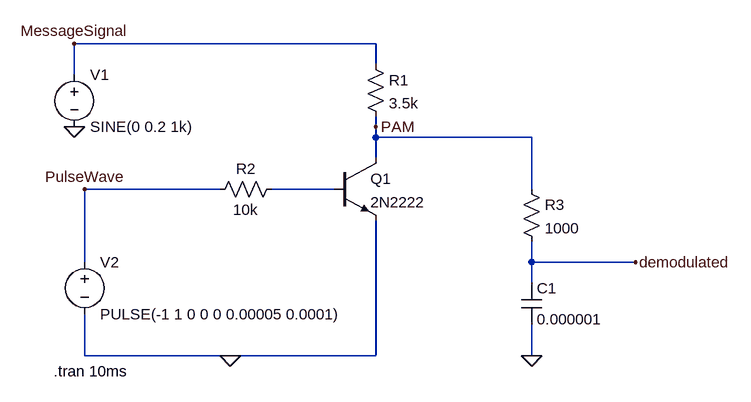
[diagram p0: schematic pam_demod_natural.asc]
pam_demod_natural.asc, the LTspice schematic file:
Version 4
SHEET 1 880 680
WIRE -400 -48 -864 -48
WIRE -400 -16 -400 -48
WIRE -864 0 -864 -48
WIRE -400 80 -400 64
WIRE -400 96 -400 80
WIRE -160 96 -400 96
WIRE -400 128 -400 96
WIRE -640 176 -848 176
WIRE -464 176 -560 176
WIRE -160 176 -160 96
WIRE -848 288 -848 176
WIRE -160 288 -160 256
WIRE 0 288 -160 288
WIRE -160 320 -160 288
WIRE -848 432 -848 368
WIRE -624 432 -848 432
WIRE -400 432 -400 224
WIRE -400 432 -624 432
WIRE -160 432 -160 384
FLAG -864 80 0
FLAG -624 432 0
FLAG -400 80 PAM
FLAG -864 -48 MessageSignal
FLAG -848 176 PulseWave
FLAG -160 432 0
FLAG 0 288 demodulated
SYMBOL npn -464 128 R0
SYMATTR InstName Q1
SYMATTR Value 2N2222
SYMBOL res -416 -32 R0
SYMATTR InstName R1
SYMATTR Value 3.5k
SYMBOL res -544 160 R90
WINDOW 0 0 56 VBottom 2
WINDOW 3 32 56 VTop 2
SYMATTR InstName R2
SYMATTR Value 10k
SYMBOL voltage -864 -16 R0
WINDOW 123 0 0 Left 0
WINDOW 39 0 0 Left 0
SYMATTR InstName V1
SYMATTR Value SINE(0 0.2 1k)
SYMBOL voltage -848 272 R0
WINDOW 123 0 0 Left 0
WINDOW 39 0 0 Left 0
SYMATTR InstName V2
SYMATTR Value PULSE(-1 1 0 0 0 0.00005 0.0001)
SYMBOL res -176 160 R0
SYMATTR InstName R3
SYMATTR Value 1000
SYMBOL cap -176 320 R0
SYMATTR InstName C1
SYMATTR Value 0.000001
TEXT -896 456 Left 2 !.tran 10ms

The netlist it stands for:
* pam_demod_natural.asc
Q1 PAM N001 0 0 2N2222
R1 MessageSignal PAM 3.5k
R2 N001 PulseWave 10k
V1 MessageSignal 0 SINE(0 0.2 1k)
V2 PulseWave 0 PULSE(-1 1 0 0 0 0.00005 0.0001)
R3 PAM demodulated 1000
C1 demodulated 0 0.000001
.model NPN NPN
.model PNP PNP
.lib standard.bjt
.tran 10ms
.backanno
.end